# Altium project multi_power_amp.PrjPcb
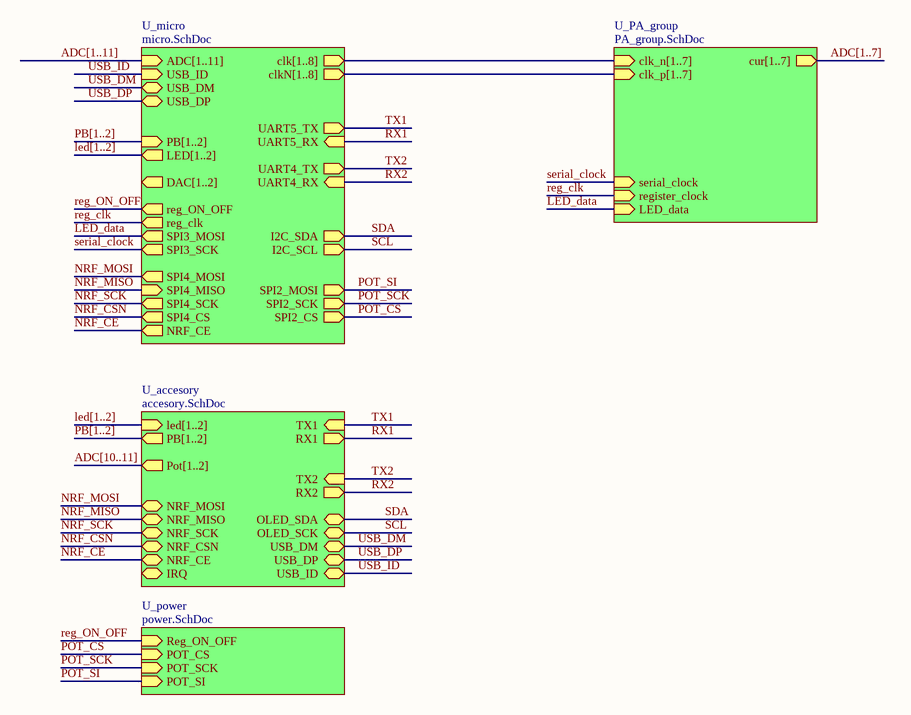
[diagram p0: top.SchDoc]
8 sheets, 274 parts. Net scope: hierarchical (ports join the sheet entries above them; power ports are global).
Board file: PowerAMP.PcbDoc
Sheets:
  top.SchDoc
    U_micro = micro.SchDoc
    U_accesory = accesory.SchDoc
    U_PA_group = PA_group.SchDoc
      PA1 = PA_classD.SchDoc
        L = led_PA.SchDoc
      PA2 = PA_classD.SchDoc
        L = led_PA.SchDoc
      PA3 = PA_classD.SchDoc
        L = led_PA.SchDoc
      PA4 = PA_classD.SchDoc
        L = led_PA.SchDoc
      PA5 = PA_classD.SchDoc
        L = led_PA.SchDoc
      PA6 = PA_classD.SchDoc
        L = led_PA.SchDoc
      PA7 = PA_classD.SchDoc
        L = led_PA.SchDoc
      Rect = rectifiers.SchDoc
    U_power = power.SchDoc

## Sheet top.SchDoc
size A4

### Sub-sheets
U_accesory = accesory.SchDoc: led[1..2] (in), PB[1..2] (out), Pot[1..2] (out), OLED_SCK (bidir), OLED_SDA (bidir), NRF_MISO (bidir), NRF_MOSI (bidir), NRF_SCK (bidir), NRF_CSN (bidir), NRF_CE (bidir), IRQ (bidir), RX1 (out), RX2 (out), TX1 (in), TX2 (in), USB_DM (bidir), USB_DP (bidir), USB_ID (bidir)
U_micro = micro.SchDoc: ADC[1..11] (in), DAC[1..2] (out), USB_ID (in), USB_DM (bidir), USB_DP (bidir), clk[1..8] (out), clkN[1..8] (out), SPI2_MOSI (out), SPI3_SCK (out), UART5_TX (out), SPI4_SCK (out), SPI4_CS (out), SPI4_MISO (in), SPI4_MOSI (out), SPI3_MOSI (out), UART5_RX (in), SPI2_SCK (out), SPI2_CS (out), I2C_SDA (out), I2C_SCL (out), LED[1..2] (out), PB[1..2] (in), reg_clk (out), reg_ON_OFF (out), NRF_CE (out), UART4_RX (in), UART4_TX (out)
U_PA_group = PA_group.SchDoc: serial_clock (in), register_clock (in), LED_data (in), clk_n[1..7] (in), clk_p[1..7] (in), cur[1..7] (out)
U_power = power.SchDoc: Reg_ON_OFF (in), POT_CS (in), POT_SCK (in), POT_SI (in)

### Nets
LED_data: sheet U_micro/SPI3_MOSI, sheet U_PA_group/LED_data
NRF_CE: sheet U_micro/NRF_CE, sheet U_accesory/NRF_CE
NRF_CSN: sheet U_micro/SPI4_CS, sheet U_accesory/NRF_CSN
NRF_MISO: sheet U_micro/SPI4_MISO, sheet U_accesory/NRF_MISO
NRF_MOSI: sheet U_micro/SPI4_MOSI, sheet U_accesory/NRF_MOSI
NRF_SCK: sheet U_micro/SPI4_SCK, sheet U_accesory/NRF_SCK
POT_CS: sheet U_micro/SPI2_CS, sheet U_power/POT_CS
POT_SCK: sheet U_micro/SPI2_SCK, sheet U_power/POT_SCK
POT_SI: sheet U_micro/SPI2_MOSI, sheet U_power/POT_SI
reg_clk: sheet U_micro/reg_clk, sheet U_PA_group/register_clock
reg_ON_OFF: sheet U_micro/reg_ON_OFF, sheet U_power/Reg_ON_OFF
RX1: sheet U_micro/UART5_RX, sheet U_accesory/RX1
RX2: sheet U_micro/UART4_RX, sheet U_accesory/RX2
SCL: sheet U_micro/I2C_SCL, sheet U_accesory/OLED_SCK  [project net I2C_SCL]
SDA: sheet U_micro/I2C_SDA, sheet U_accesory/OLED_SDA  [project net I2C_SDA]
serial_clock: sheet U_micro/SPI3_SCK, sheet U_PA_group/serial_clock
TX1: sheet U_micro/UART5_TX, sheet U_accesory/TX1
TX2: sheet U_micro/UART4_TX, sheet U_accesory/TX2
USB_DM: sheet U_micro/USB_DM, sheet U_accesory/USB_DM
USB_DP: sheet U_micro/USB_DP, sheet U_accesory/USB_DP
USB_ID: sheet U_micro/USB_ID, sheet U_accesory/USB_ID

### Buses and harness runs
bus ADC[1..7] = sheet U_PA_group/cur[1..7]
bus ADC[1..11] = sheet U_micro/ADC[1..11]
bus ADC[10..11] = sheet U_accesory/Pot[1..2]
bus led[1..2] = sheet U_accesory/led[1..2]
bus led[1..2] = sheet U_micro/LED[1..2]
bus PB[1..2] = sheet U_accesory/PB[1..2]
bus PB[1..2] = sheet U_micro/PB[1..2]
bus sheet U_micro/clk[1..8] = sheet U_PA_group/clk_n[1..7]
bus sheet U_micro/clkN[1..8] = sheet U_PA_group/clk_p[1..7]

## Sheet micro.SchDoc
size A4
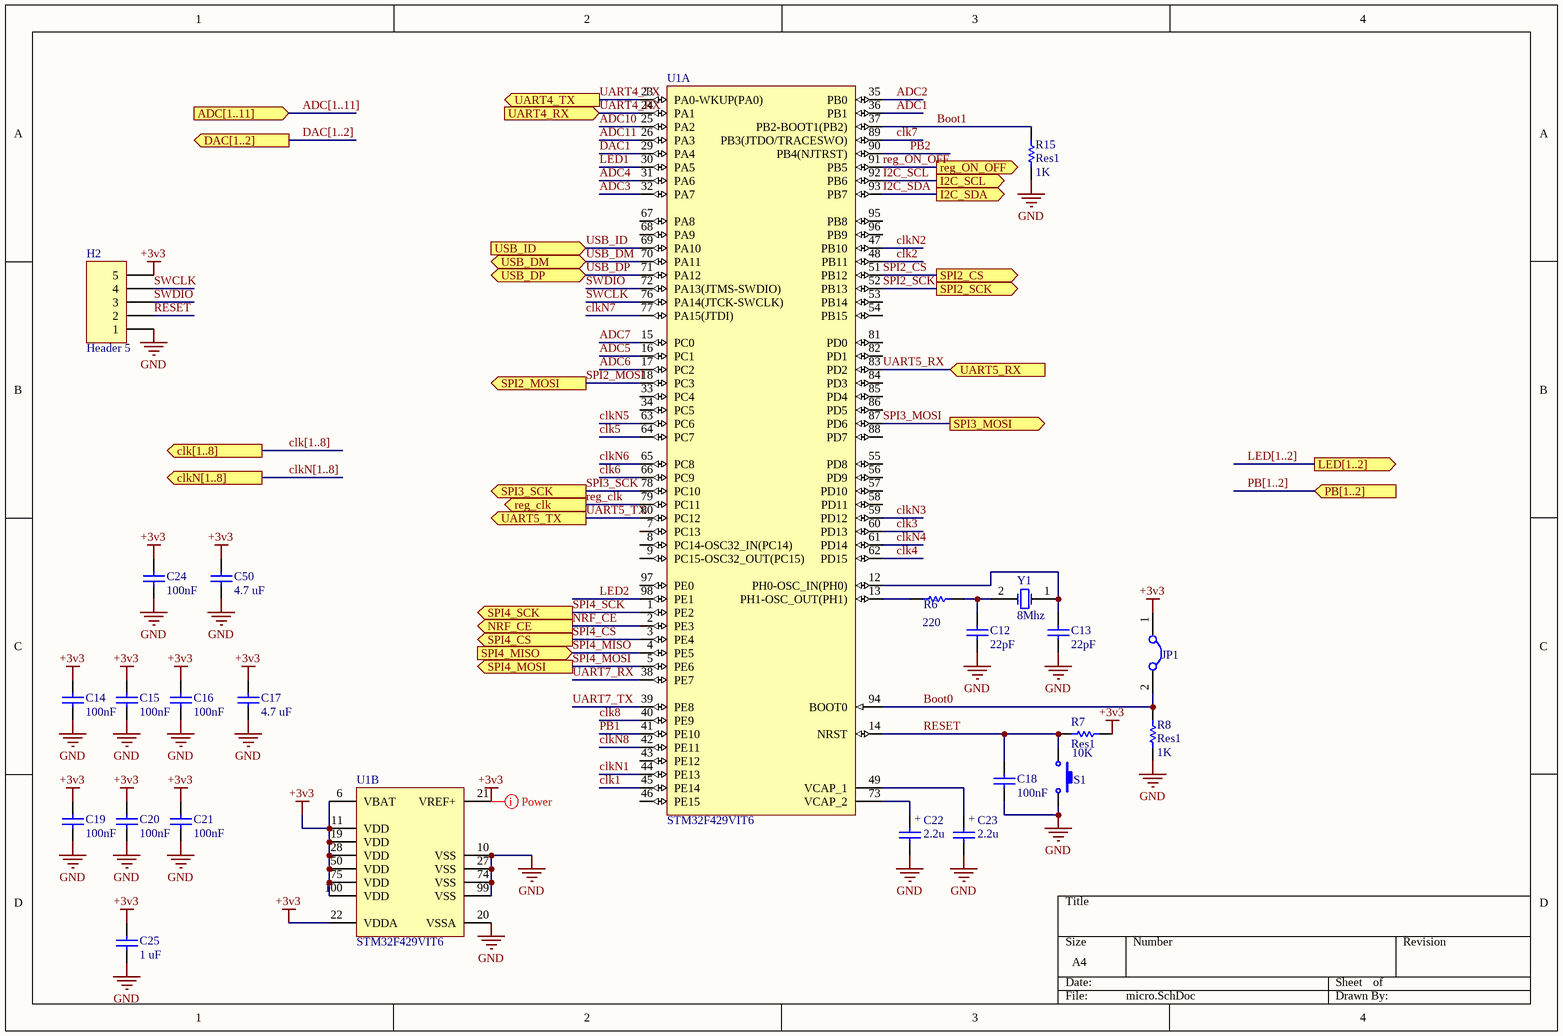
[diagram p1: micro.SchDoc]

### Parts
C12  value 22pF  [SMD_CAP_0805]  (hidden comment: Cap)
C13  value 22pF  [SMD_CAP_0805]  (hidden comment: Cap)
C14  100nF  [SMD_CAP_0805]
C15  100nF  [SMD_CAP_0805]
C16  100nF  [SMD_CAP_0805]
C17  value 4.7 uF  [SMD_CAP_0805]  (hidden comment: Cap)
C18  value 100nF  [SMD_CAP_0805]  (hidden comment: Cap)
C19  100nF  [SMD_CAP_0805]
C20  100nF  [SMD_CAP_0805]
C21  100nF  [SMD_CAP_0805]
C22  value 2.2u  [CAPP 1206 (3216X18L) Size A]  (hidden comment: tantal size a)
C23  value 2.2u  [CAPP 1206 (3216X18L) Size A]  (hidden comment: tantal size a)
C24  100nF  [SMD_CAP_0805]
C25  value 1 uF  [CAPP 1206 (3216X18L) Size A]  (hidden comment: Cap)
C50  value 4.7 uF  [SMD_CAP_0805]  (hidden comment: Cap)
H2  Header 5  [HDR1X5]
JP1  Jumper  [Jumper Small - 2.54 - GRAY]  (value not drawn)
R6  value 220  [RES 0805 (2012X06L)]  (hidden comment: Res1)
R7  Res1  value 10K  [RES 0805 (2012X06L)]
R8  Res1  value 1K  [RES 0805 (2012X06L)]
R15  Res1  value 1K  [RES 0805 (2012X06L)]
S1  Switch PB  [Switch - Push to On]  (value not drawn)
U1  STM32F429VIT6  [STM-LQFP100_M]  (parts A,B of 2)
Y1  8Mhz  [CRYSTAL Small]

### Ports
ADC[1..11] (in), clk[1..8] (out), clkN[1..8] (out), DAC[1..2] (out), I2C_SCL (out), I2C_SDA (out), LED[1..2] (out), NRF_CE (out), PB[1..2] (in), reg_clk (out), reg_ON_OFF (out), SPI2_CS (out), SPI2_MOSI (out), SPI2_SCK (out), SPI3_MOSI (out), SPI3_SCK (out), SPI4_CS (out), SPI4_MISO (in), SPI4_MOSI (out), SPI4_SCK (out), UART4_RX (in), UART4_TX (out), UART5_RX (in), UART5_TX (out), USB_DM (bidir), USB_DP (bidir), USB_ID (in)

### Nets
+3v3: C14.2 C15.2 C16.2 C17.1 C19.2 C20.2 C21.2 C24.2 C25.1 C50.1 H2.5 JP1.1 R7.1 U1.6(VBAT) U1.11(VDD) U1.19(VDD) U1.21(VREF+) U1.22(VDDA) U1.28(VDD) U1.50(VDD) U1.75(VDD) U1.100(VDD)
GND: C12.1 C13.1 C14.1 C15.1 C16.1 C17.2 C18.1 C19.1 C20.1 C21.1 C22.- C23.- C24.1 C25.2 C50.2 H2.1 R8.1 R15.1 S1.2 U1.10(VSS) U1.20(VSSA) U1.27(VSS) U1.74(VSS) U1.99(VSS)
ADC1: U1.36(PB1)
ADC2: U1.35(PB0)
ADC3: U1.32(PA7)
ADC4: U1.31(PA6)
ADC5: U1.16(PC1)
ADC6: U1.17(PC2)
ADC7: U1.15(PC0)
ADC10: U1.25(PA2)
ADC11: U1.26(PA3)
Boot0: JP1.2 R8.2 U1.94(BOOT0)
Boot1: R15.2 U1.37(PB2-BOOT1(PB2))
clk1: U1.45(PE14)
clk2: U1.48(PB11)
clk3: U1.60(PD13)
clk4: U1.62(PD15)
clk5: U1.64(PC7)
clk6: U1.66(PC9)
clk7: U1.89(PB3(JTDO/TRACESWO))
clk8: U1.40(PE9)
clkN1: U1.44(PE13)  [project net clk_p1]
clkN2: U1.47(PB10)  [project net clk_p2]
clkN3: U1.59(PD12)  [project net clk_p3]
clkN4: U1.61(PD14)  [project net clk_p4]
clkN5: U1.63(PC6)  [project net clk_p5]
clkN6: U1.65(PC8)  [project net clk_p6]
clkN7: U1.77(PA15(JTDI))  [project net clk_p7]
clkN8: U1.42(PE11)
DAC1: U1.29(PA4)
I2C_SCL: U1.92(PB6) ; port I2C_SCL
I2C_SDA: U1.93(PB7) ; port I2C_SDA
LED1: U1.30(PA5)
LED2: U1.98(PE1)
NRF_CE: U1.2(PE3) ; port NRF_CE
PB1: U1.41(PE10)
PB2: U1.90(PB4(NJTRST))
reg_clk: U1.79(PC11) ; port reg_clk
reg_ON_OFF: U1.91(PB5) ; port reg_ON_OFF
RESET: C18.2 H2.2 R7.2 S1.1 U1.14(NRST)
SPI2_CS: U1.51(PB12) ; port SPI2_CS  [project net POT_CS]
SPI2_MOSI: U1.18(PC3) ; port SPI2_MOSI  [project net POT_SI]
SPI2_SCK: U1.52(PB13) ; port SPI2_SCK  [project net POT_SCK]
SPI3_MOSI: U1.87(PD6) ; port SPI3_MOSI  [project net LED_data]
SPI3_SCK: U1.78(PC10) ; port SPI3_SCK  [project net serial_clock]
SPI4_CS: U1.3(PE4) ; port SPI4_CS  [project net NRF_CSN]
SPI4_MISO: U1.4(PE5) ; port SPI4_MISO  [project net NRF_MISO]
SPI4_MOSI: U1.5(PE6) ; port SPI4_MOSI  [project net NRF_MOSI]
SPI4_SCK: U1.1(PE2) ; port SPI4_SCK  [project net NRF_SCK]
SWCLK: H2.4 U1.76(PA14(JTCK-SWCLK))
SWDIO: H2.3 U1.72(PA13(JTMS-SWDIO))
UART4_RX: U1.24(PA1) ; port UART4_RX  [project net RX2]
UART4_TX: U1.23(PA0-WKUP(PA0)) ; port UART4_TX  [project net TX2]
UART5_RX: U1.83(PD2) ; port UART5_RX  [project net RX1]
UART5_TX: U1.80(PC12) ; port UART5_TX  [project net TX1]
UART7_RX: U1.38(PE7)
UART7_TX: U1.39(PE8)
USB_DM: U1.70(PA11) ; port USB_DM
USB_DP: U1.71(PA12) ; port USB_DP
USB_ID: U1.69(PA10) ; port USB_ID
NetC12_2: C12.2 R6.2 Y1.2(OSC2)
NetC13_2: C13.2 U1.12(PH0-OSC_IN(PH0)) Y1.1(OSC1)
NetC22_+: C22.+ U1.73(VCAP_2)
NetC23_+: C23.+ U1.49(VCAP_1)
NetR6_1: R6.1 U1.13(PH1-OSC_OUT(PH1))

Not connected (* = marked no-connect by the designer): U1 7(PC13) 8(PC14-OSC32_IN(PC14)) 9(PC15-OSC32_OUT(PC15)) 33(PC4) 34(PC5) 43(PE12) 46(PE15) 53(PB14) 54(PB15) 55(PD8) 56(PD9) 57(PD10) 58(PD11) 67(PA8) 68(PA9) 81(PD0) 82(PD1) 84(PD3) 85(PD4) 86(PD5) 88(PD7) 95(PB8) 96(PB9) 97(PE0)

### Buses and harness runs
bus ADC[1..11] = port ADC[1..11]
bus clk[1..8] = port clk[1..8]
bus clkN[1..8] = port clkN[1..8]
bus DAC[1..2] = port DAC[1..2]
bus LED[1..2] = port LED[1..2]
bus PB[1..2] = port PB[1..2]

### Layout directives
net class Power: +3v3

### Library data of the parts
C12-C16 C18-C21 C24 = Cap: Capacitor; Published: 8-Jun-2000; LatestRevisionDate: 17-Jul-2002; LatestRevisionNote: Re-released for DXP Platform.; PackageReference: RAD-0.3; Publisher: Altium Limited; PackageDescription: Radial Cap, Thru-Hole; 2 Leads; 0.3 in Pin Spacing
  C14-C16 C19-C21 C24: Value: 100nF
C22 C23 = Cap Pol: pin to pad: +>1 ->2
H2 = Header 5: Header, 5-Pin; LatestRevisionDate: 17-Jul-2002; LatestRevisionNote: Re-released for DXP Platform.; Publisher: Altium Limited
JP1 = Jumper: Company: E.P.I.L; Defualt State: Close; Design Date: 2011/11/02
R6-R8 R15 = Res1: Resistor; Published: 8-Jun-2000; LatestRevisionDate: 17-Jul-2002; LatestRevisionNote: Re-released for DXP Platform.; PackageReference: AXIAL-0.3; Publisher: Altium Limited; PackageDescription: Axial Device, Thru-Hole; 2 Leads; 0.3 in Pin Spacing
S1 = Switch PB: Push Button Switch
U1 = STM32F429VIT6: ARM Cortex-M4 32-bit MCU+FPU, 225 DMIPS, 2048 kB Flash, 256 kB Internal RAM, 82 I/Os, 100-pin LQFP, -40 to 85 degC, Tray; Manufacturer: STMicroelectronics; D/A Converter: 2x12-bit; FLASH Size (Prog) (kB): 2048; I/Os (High Current): 82; Internal RAM Size (kB): 256; Operating Frequency(F) (Processor speed) (MHz): 180; Supply Voltage(Vcc) max (V): 3.6; Supply Voltage(Vcc) min (V): 1.8; DatasheetVersion: Rev. 2; PackageVersion: Rev. 1, 06/2013; PackageReference: LQFP100; PackageDescription: 100-Pin Low Profile Quad Flat Package, 14 x 14 mm Body, 0.5 mm Pitch; Supplier 1: Digi-Key; Supplier Part Number 1: 497-14052-ND; Supplier 2: Newark; Supplier Part Number 2: 06X3674; Supplier 3: Mouser; Supplier Part Number 3: 511-STM32F429VIT6; Core: ARM Cortex-M4; Packing: Tray; Mounting Technology: Surface Mount; PartNumber: STM32F429VIT6; ComponentLink1Description: Manufacturer URL; ComponentLink1URL: http://www.st.com/web/en/home.html; ComponentLink2Description: Datasheet; ComponentLink2URL: http://www.st.com/st-web-ui/static/active/en/resource/technical/document/data_brief/DM00053488.pdf; ComponentLink3Description: Package Specification; ComponentLink3URL: http://www.st.com/st-web-ui/static/active/en/resource/technical/document/data_brief/DM00071938.pdf
Y1 = XTAL: Crystal Oscillator; Published: 8-Jun-2000; LatestRevisionDate: 17-Jul-2002; LatestRevisionNote: Re-released for DXP Platform.; PackageReference: R38; Publisher: Altium Limited; PackageDescription: Crystal, Thru-Hole; 2 Leads; Body 3.1 x 8.2 mm (Dia.xH)

## Sheet accesory.SchDoc
size A4
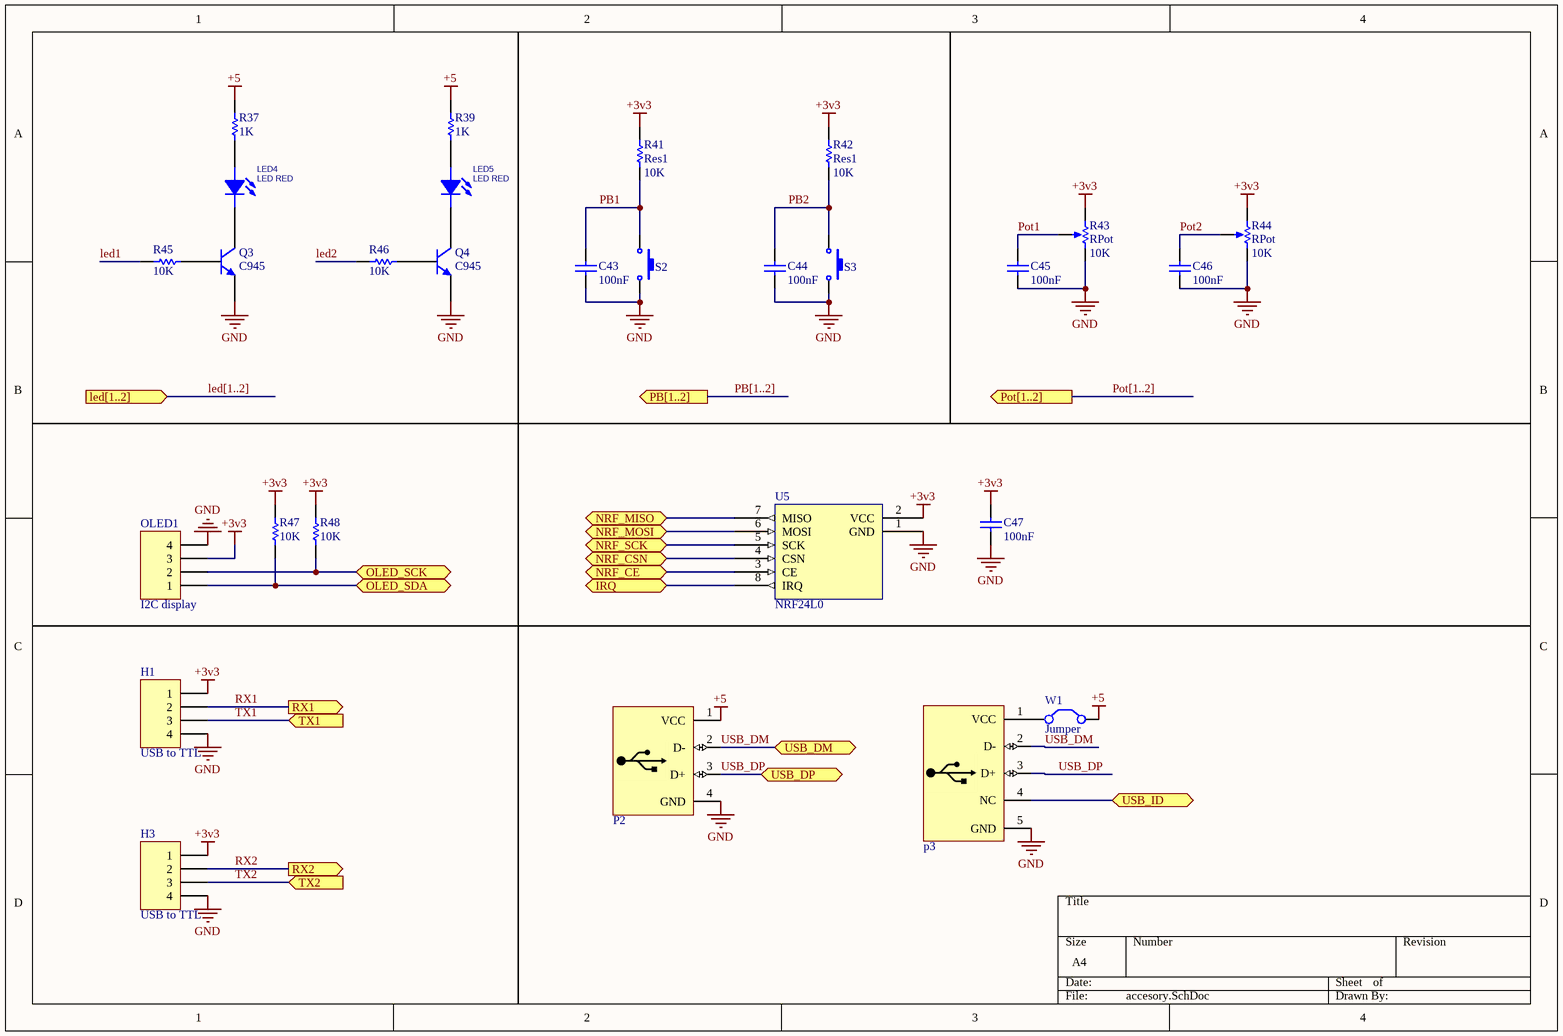
[diagram p2: accesory.SchDoc]

### Parts
C43  value 100nF  [SMD_CAP_0805]  (hidden comment: Cap)
C44  value 100nF  [SMD_CAP_0805]  (hidden comment: Cap)
C45  value 100nF  [SMD_CAP_0805]  (hidden comment: Cap)
C46  value 100nF  [SMD_CAP_0805]  (hidden comment: Cap)
C47  value 100nF  [SMD_CAP_0805]  (hidden comment: Cap)
H1  USB to TTL  [HDR1X4]
H3  USB to TTL  [HDR1X4]
LED4  LED RED  [led_0805]
LED5  LED RED  [led_0805]
OLED1  I2C display  [HDR1X4]
P2  USB Connector  [USB2.5-2H4C]  (value not drawn)
p3  USB Connector  [USB_AB_BM_SHS]  (value not drawn)
Q3  C945  [SOT23_N]
Q4  C945  [SOT23_N]
R37  1K  [RES 0805 (2012X06L)]
R39  1K  [RES 0805 (2012X06L)]
R41  Res1  value 10K  [RES 0805 (2012X06L)]
R42  Res1  value 10K  [RES 0805 (2012X06L)]
R43  RPot  value 10K  [Multi Turn 02]
R44  RPot  value 10K  [Multi Turn 02]
R45  value 10K  [RES 0805 (2012X06L)]  (hidden comment: Res1)
R46  value 10K  [RES 0805 (2012X06L)]  (hidden comment: Res1)
R47  value 10K  [RES 0805 (2012X06L)]  (hidden comment: Res1)
R48  value 10K  [RES 0805 (2012X06L)]  (hidden comment: Res1)
S2  Switch PB  [Switch - Push to On]  (value not drawn)
S3  Switch PB  [Switch - Push to On]  (value not drawn)
U5  NRF24L0  [RF24-MICRO STRIP]
W1  Jumper  [Jumper SMD]

### Ports
IRQ (bidir), led[1..2] (in), NRF_CE (bidir), NRF_CSN (bidir), NRF_MISO (bidir), NRF_MOSI (bidir), NRF_SCK (bidir), OLED_SCK (bidir), OLED_SDA (bidir), PB[1..2] (out), Pot[1..2] (out), RX1 (out), RX2 (out), TX1 (in), TX2 (in), USB_DM (bidir), USB_DP (bidir), USB_ID (bidir)

### Nets
+3v3: C47.2 H1.1 H3.1 OLED1.3 R41.1 R42.1 R43.1(TOP) R44.1(TOP) R47.2 R48.2 U5.2(VCC)
+5: P2.1(VCC) R37.2 R39.2 W1.2(C2)
GND: C43.1 C44.1 C45.1 C46.1 C47.1 H1.4 H3.4 OLED1.4 P2.4(GND) p3.5(GND) Q3.2(E) Q4.2(E) R43.2(BOT) R44.2(BOT) S2.2 S3.2 U5.1(GND)
I2C_SCL: OLED1.2 R48.1 ; port OLED_SCK
I2C_SDA: OLED1.1 R47.1 ; port OLED_SDA
LED1: R45.1
LED2: R46.1
NRF_CE: U5.3(CE) ; port NRF_CE
NRF_CSN: U5.4(CSN) ; port NRF_CSN
NRF_MISO: U5.7(MISO) ; port NRF_MISO
NRF_MOSI: U5.6(MOSI) ; port NRF_MOSI
NRF_SCK: U5.5(SCK) ; port NRF_SCK
PB1: C43.2 R41.2 S2.1
PB2: C44.2 R42.2 S3.1
Pot1: C45.2 R43.3(TAP)  [project net ADC10]
Pot2: C46.2 R44.3(TAP)  [project net ADC11]
RX1: H1.2 ; port RX1
RX2: H3.2 ; port RX2
TX1: H1.3 ; port TX1
TX2: H3.3 ; port TX2
USB_DM: P2.2(D-) p3.2(D-) ; port USB_DM
USB_DP: P2.3(D+) p3.3(D+) ; port USB_DP
USB_ID: p3.4(NC) ; port USB_ID
NetLED4_1: LED4.1(ANODE) R37.1
NetLED4_2: LED4.2(CATHODE) Q3.3(C)
NetLED5_1: LED5.1(ANODE) R39.1
NetLED5_2: LED5.2(CATHODE) Q4.3(C)
Netp3_1: p3.1(VCC) W1.1(C1)
NetQ3_1: Q3.1(B) R45.2
NetQ4_1: Q4.1(B) R46.2
NetU5_8: U5.8(IRQ) ; port IRQ

### Buses and harness runs
bus led[1..2] = port led[1..2]
bus PB[1..2] = port PB[1..2]
bus Pot[1..2] = port Pot[1..2]

### Library data of the parts
C43-C47 = Cap: Capacitor; Published: 8-Jun-2000; LatestRevisionDate: 17-Jul-2002; LatestRevisionNote: Re-released for DXP Platform.; PackageReference: RAD-0.3; Publisher: Altium Limited; PackageDescription: Radial Cap, Thru-Hole; 2 Leads; 0.3 in Pin Spacing
H1 H3 = H-1x4
LED4 LED5 = LED 5MM: Light Emitting Diode; Designer: Abbas Basereh; Data: 16-12-2016; Link: *; Part.No: *
OLED1 = Header 4: Header, 4-Pin; LatestRevisionDate: 17-Jul-2002; LatestRevisionNote: Re-released for DXP Platform.; Publisher: Altium Limited
P2 = USB A-Type: USB Connector-A Type
p3 = USB MICRO: USB Connector MICRO-B Type; Designer: ABBAS BASEREH; Max Current: 1600mA; Mounting Technology: Surface Mount\Through-Hole; Category: Connector; Pin Count: 5-7; Publisher: ABBAS BASEREH; Status: Unreleased; ComponentLink1Description: Datasheet; ComponentLink2Description: Reference; Update: 1395-11-17
Q3 Q4 = C945: NPN Silicon Epitaxial Planar Transistor; Published: 2017-2-8; LatestRevisionDate: 2017; LatestRevisionNote: IPC-7351 Footprint Added.; DatasheetVersion: 2017; PackageVersion: 2017-2-8; PackageReference: SOT23; Publisher: Abbas Basereh; PackageDescription: 3-Pin SOT-23 Package 0.95 mm Pitch, 2.3 mm Lead Span; ComponentLink1Description: Manufacturer Link; ComponentLink1URL: http://www.taitroncomponents.com/; ComponentLink2Description: Datasheet; ComponentLink2URL: http://www.taitroncomponents.com/
R37 R39 = RES Axial 0.25W: Designer: Abbas Basereh; Desc.: RES Axial 0.25W; Data: 4-1-2017
R41 R42 R45-R48 = Res1: Resistor; Published: 8-Jun-2000; LatestRevisionDate: 17-Jul-2002; LatestRevisionNote: Re-released for DXP Platform.; PackageReference: AXIAL-0.3; Publisher: Altium Limited; PackageDescription: Axial Device, Thru-Hole; 2 Leads; 0.3 in Pin Spacing
R43 R44 = RPot: Potentiometer; Sim Note: Enter the Resistance value and the set point into parameter fields.; Set Position: 0.5; Published: 8-Jun-2000; LatestRevisionDate: 17-Jul-2002; LatestRevisionNote: Re-released for DXP Platform.; PackageReference: VR5; Publisher: Altium Limited; PackageDescription: Variable Resistor, Thru-Hole; 3 Leads
S2 S3 = Switch PB: Push Button Switch
U5 = NRF24
W1 = Jumper: Jumper Wire; Published: 24-Mar-1999; LatestRevisionDate: 17-Jul-2002; LatestRevisionNote: Re-released for DXP Platform.; PackageReference: RAD-0.2; Publisher: Altium Limited; PackageDescription: Radial Cap, Thru-Hole; 2 Leads; 0.2 in Pin Spacing

## Sheet PA_group.SchDoc
size A4
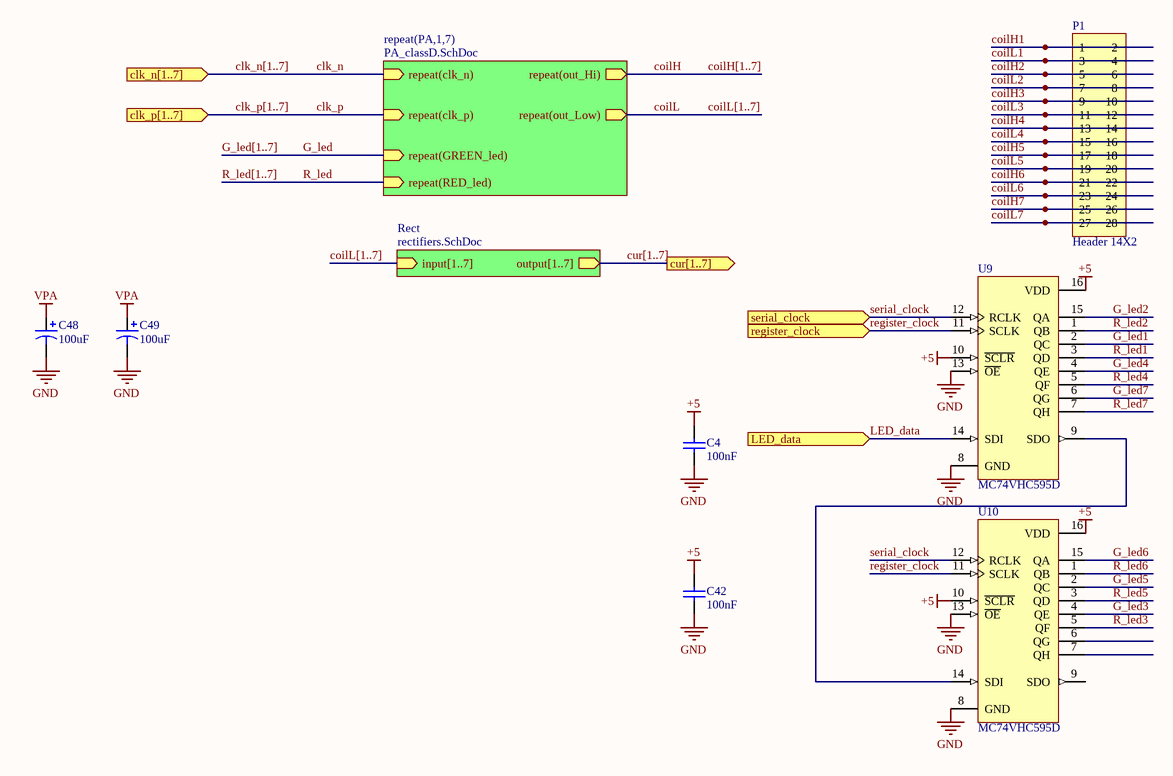
[diagram p3: PA_group.SchDoc]

### Parts
C4  value 100nF  [SMD_CAP_0805]  (hidden comment: Cap)
C42  value 100nF  [SMD_CAP_0805]  (hidden comment: Cap)
C48  value 100uF  [Cap SMD electrolite-6.3mm]
C49  value 100uF  [Cap SMD electrolite-6.3mm]
P1  Header 14X2  [HDR2X14]
U9  MC74VHC595D  [751B-05_N]
U10  MC74VHC595D  [751B-05_N]

### Sub-sheets
Rect = rectifiers.SchDoc: input[1..7] (in), output[1..7] (out)
repeat(PA,1,7) = PA_classD.SchDoc: repeat(clk_n) (in), repeat(clk_p) (in), repeat(out_Hi) (out), repeat(out_Low) (out), repeat(GREEN_led) (in), repeat(RED_led) (in)

### Ports
clk_n[1..7] (in), clk_p[1..7] (in), cur[1..7] (out), LED_data (in), register_clock (in), serial_clock (in)

### Nets
+5: C4.1 C42.1 U9.10(~{SCLR}) U9.16(VDD) U10.10(~{SCLR}) U10.16(VDD)
GND: C4.2 C42.2 C48.2 C49.2 U9.8(GND) U9.13(~{OE}) U10.8(GND) U10.13(~{OE})
VPA: C48.1 C49.1
clk_n: sheet repeat(PA,1,7)/repeat(clk_n)
clk_p: sheet repeat(PA,1,7)/repeat(clk_p)
coilH: sheet repeat(PA,1,7)/repeat(out_Hi)
coilH1: P1.1 P1.2
coilH2: P1.5 P1.6
coilH3: P1.9 P1.10
coilH4: P1.13 P1.14
coilH5: P1.17 P1.18
coilH6: P1.21 P1.22
coilH7: P1.25 P1.26
coilL: sheet repeat(PA,1,7)/repeat(out_Low)
coilL1: P1.3 P1.4
coilL2: P1.7 P1.8
coilL3: P1.11 P1.12
coilL4: P1.15 P1.16
coilL5: P1.19 P1.20
coilL6: P1.23 P1.24
coilL7: P1.27 P1.28
G_led: sheet repeat(PA,1,7)/repeat(GREEN_led)
G_led1: U9.2(QC)
G_led2: U9.15(QA)
G_led3: U10.4(QE)
G_led4: U9.4(QE)
G_led5: U10.2(QC)
G_led6: U10.15(QA)
G_led7: U9.6(QG)
LED_data: U9.14(SDI) ; port LED_data
R_led: sheet repeat(PA,1,7)/repeat(RED_led)
R_led1: U9.3(QD)
R_led2: U9.1(QB)
R_led3: U10.5(QF)
R_led4: U9.5(QF)
R_led5: U10.3(QD)
R_led6: U10.1(QB)
R_led7: U9.7(QH)
register_clock: U9.11(SCLK) U10.11(SCLK) ; port register_clock  [project net reg_clk]
serial_clock: U9.12(RCLK) U10.12(RCLK) ; port serial_clock
NetU9_9: U9.9(SDO) U10.14(SDI)

Not connected (* = marked no-connect by the designer): U10 6(QG) 7(QH) 9(SDO)

### Buses and harness runs
bus clk_n[1..7] = port clk_n[1..7]
bus clk_p[1..7] = port clk_p[1..7]
bus coilH[1..7]
bus coilL[1..7]
bus coilL[1..7] = sheet Rect/input[1..7]
bus cur[1..7] = port cur[1..7] = sheet Rect/output[1..7]
bus G_led[1..7]
bus R_led[1..7]

### Library data of the parts
C4 C42 = Cap ceramic: CAP-100Nf
C48 C49 = Cap Pol1: Polarized Capacitor (Radial); Published: 8-Jun-2000; LatestRevisionDate: 17-Jul-2002; LatestRevisionNote: Re-released for DXP Platform.; PackageReference: RB7.6-15; Publisher: Altium Limited; PackageDescription: Polarized Capacitor (Radial); 2 Leads
P1 = Header 14X2: Header, 14-Pin, Dual row; LatestRevisionDate: 17-Jul-2002; LatestRevisionNote: Re-released for DXP Platform.; Publisher: Altium Limited
U9 U10 = MC74VHC595D: 8-Bit 3-State Shift Register with Output Storage Register; ComponentAvailability: Not for New Design; Published: 15-Apr-2002; LatestRevisionDate: 13-Apr-2006; LatestRevisionNote: IPC-7351 Footprint Added.; DatasheetVersion: 1997; PackageVersion: Oct-1999; PackageReference: 751B-05; Publisher: Altium Limited; PackageDescription: 16-Pin Small Outline Integrated Circuit 1.27 mm Pitch; Code_JEDEC: MS-012-AC; Code_IPC: SOIC127P600-16; ComponentLink1Description: Manufacturer Link; ComponentLink1URL: http://www.onsemi.com/; ComponentLink2Description: Datasheet; ComponentLink2URL: http://www.onsemi.com/pub/Collateral/MC74VHC595-D.PDF

## Sheet PA_classD.SchDoc
size A4
Used 7 times, as channels U_PA_group/PA1, U_PA_group/PA2, U_PA_group/PA3, U_PA_group/PA4, U_PA_group/PA5, U_PA_group/PA6, U_PA_group/PA7. Parts and nets are listed once, with the designators drawn on the sheet.
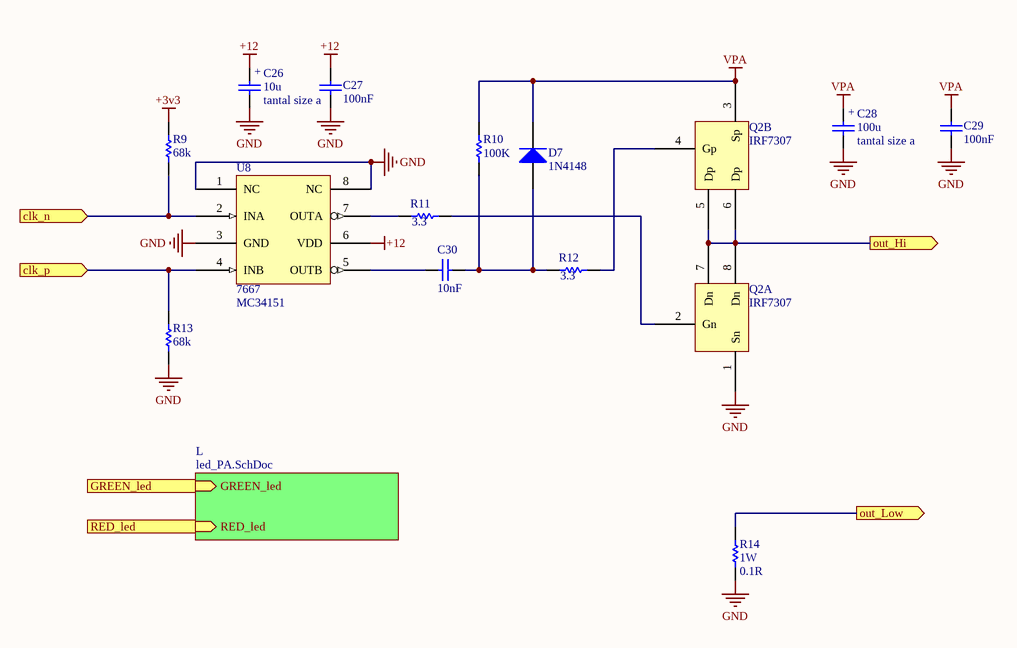
[diagram p4: PA_classD.SchDoc]

### Parts
C26  tantal size a  value 10u  [CAPP 1206 (3216X18L) Size A]
C27  value 100nF  [SMD_CAP_0805]  (hidden comment: Cap)
C28  tantal size a  value 100u  [CAPP 1206 (3216X18L) Size A]
C29  value 100nF  [SMD_CAP_0805]  (hidden comment: Cap)
C30  value 10nF  [SMD_CAP_0805]  (hidden comment: Cap)
D7  1N4148  [LL4148]
Q2  IRF7307  [SO8_M]  (parts A,B of 2)
R9  value 68k  [RES 0805 (2012X06L)]  (hidden comment: Res1)
R10  value 100K  [RES 0805 (2012X06L)]  (hidden comment: Res1)
R11  value 3.3  [RES 0805 (2012X06L)]  (hidden comment: Res1)
R12  value 3.3  [RES 0805 (2012X06L)]  (hidden comment: Res1)
R13  value 68k  [RES 0805 (2012X06L)]  (hidden comment: Res1)
R14  1W  value 0.1R  [Axial 1W  7_0mm]
U8  7667  [SO8_M]

### Sub-sheets
L = led_PA.SchDoc: GREEN_led (in), RED_led (in)

### Ports
clk_n (in), clk_p (in), GREEN_led (in), out_Hi (out), out_Low (out), RED_led (in)

### Nets
+3v3: R9.1
+12: C26.+ C27.1 U8.6(VDD)
GND: C26.- C27.2 C28.- C29.2 Q2.1(Sn) R13.2 R14.1 U8.1(NC) U8.3(GND) U8.8(NC)
VPA: C28.+ C29.1 D7.2(K) Q2.3(Sp) R10.1
clk_n: R9.2 U8.2(INA) ; port clk_n
clk_p: R13.1 U8.4(INB) ; port clk_p
GREEN_led: port GREEN_led, sheet L/GREEN_led
out_Hi: Q2.5(Dp) Q2.6(Dp) Q2.7(Dn) Q2.8(Dn) ; port out_Hi
out_Low: R14.2 ; port out_Low
RED_led: port RED_led, sheet L/RED_led
NetC30_1: C30.1 U8.5(OUTB)
NetC30_2: C30.2 D7.1(A) R10.2 R12.2
NetQ2_2: Q2.2(Gn) R11.1
NetQ2_4: Q2.4(Gp) R12.1
NetR11_2: R11.2 U8.7(OUTA)

### Channels
U_PA_group/PA1: designators end in _PA1; ports clk_n=clk1 clk_p=clk_p1 GREEN_led=G_led1 out_Hi=coilH1 out_Low=coilL1 RED_led=R_led1
U_PA_group/PA2: designators end in _PA2; ports clk_n=clk2 clk_p=clk_p2 GREEN_led=G_led2 out_Hi=coilH2 out_Low=coilL2 RED_led=R_led2
U_PA_group/PA3: designators end in _PA3; ports clk_n=clk3 clk_p=clk_p3 GREEN_led=G_led3 out_Hi=coilH3 out_Low=coilL3 RED_led=R_led3
U_PA_group/PA4: designators end in _PA4; ports clk_n=clk4 clk_p=clk_p4 GREEN_led=G_led4 out_Hi=coilH4 out_Low=coilL4 RED_led=R_led4
U_PA_group/PA5: designators end in _PA5; ports clk_n=clk5 clk_p=clk_p5 GREEN_led=G_led5 out_Hi=coilH5 out_Low=coilL5 RED_led=R_led5
U_PA_group/PA6: designators end in _PA6; ports clk_n=clk6 clk_p=clk_p6 GREEN_led=G_led6 out_Hi=coilH6 out_Low=coilL6 RED_led=R_led6
U_PA_group/PA7: designators end in _PA7; ports clk_n=clk7 clk_p=clk_p7 GREEN_led=G_led7 out_Hi=coilH7 out_Low=coilL7 RED_led=R_led7

### Notes on the sheet
- (near U8) MC34151

### Library data of the parts
C26 C28 = Cap Pol: pin to pad: +>1 ->2
C27 C29 C30 = Cap ceramic: CAP-100Nf
D7 = Diode 1N4148: High Conductance Fast Diode; Published: 8-Jun-2000; LatestRevisionDate: 17-Jul-2002; LatestRevisionNote: Re-released for DXP Platform.; DatasheetVersion: 1997; PackageReference: DO-35; Publisher: Altium Limited; PackageDescription: Diode, Axial; Body 3.8 x 1.9 mm (LxDia. max), Lead Dia. 0.53 mm (max); Code_JEDEC: DO-204-AH; ComponentLink1Description: Manufacturer Link; ComponentLink1URL: http://www.fairchildsemi.com/; ComponentLink2Description: Datasheet; ComponentLink2URL: http://www.fairchildsemi.com/ds/1N%2F1N4148.pdf
Q2 = IRF7106
R9-R14 = Res1: Resistor; Published: 8-Jun-2000; LatestRevisionDate: 17-Jul-2002; LatestRevisionNote: Re-released for DXP Platform.; PackageReference: AXIAL-0.3; Publisher: Altium Limited; PackageDescription: Axial Device, Thru-Hole; 2 Leads; 0.3 in Pin Spacing
U8 = ICL7667

## Sheet led_PA.SchDoc
size A4
Used 7 times, as channels U_PA_group/PA1/L, U_PA_group/PA2/L, U_PA_group/PA3/L, U_PA_group/PA4/L, U_PA_group/PA5/L, U_PA_group/PA6/L, U_PA_group/PA7/L. Parts and nets are listed once, with the designators drawn on the sheet.
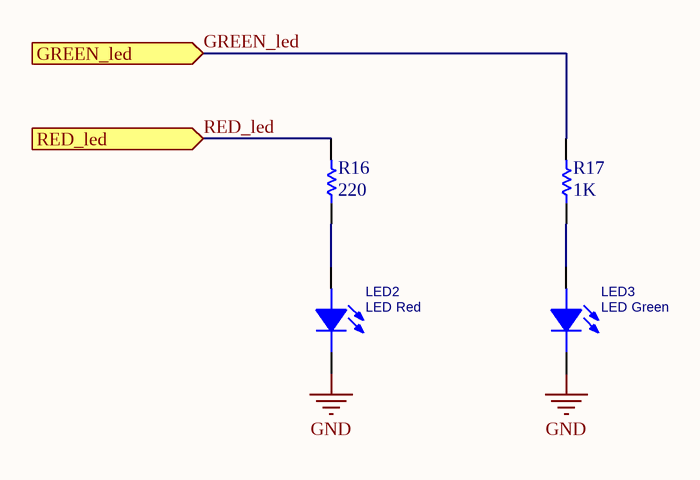
[diagram p5: led_PA.SchDoc]

### Parts
LED2  LED Red  [led_0805]
LED3  LED Green  [led_0805]
R16  220  [RES 0805 (2012X06L)]
R17  1K  [RES 0805 (2012X06L)]

### Ports
GREEN_led (in), RED_led (in)

### Nets
GND: LED2.2(CATHODE) LED3.2(CATHODE)
GREEN_led: R17.2 ; port GREEN_led
RED_led: R16.2 ; port RED_led
NetLED2_1: LED2.1(ANODE) R16.1
NetLED3_1: LED3.1(ANODE) R17.1

### Channels
U_PA_group/PA1/L: designators end in _U_PA_group_PA1_L; ports GREEN_led=G_led1 RED_led=R_led1
U_PA_group/PA2/L: designators end in _U_PA_group_PA2_L; ports GREEN_led=G_led2 RED_led=R_led2
U_PA_group/PA3/L: designators end in _U_PA_group_PA3_L; ports GREEN_led=G_led3 RED_led=R_led3
U_PA_group/PA4/L: designators end in _U_PA_group_PA4_L; ports GREEN_led=G_led4 RED_led=R_led4
U_PA_group/PA5/L: designators end in _U_PA_group_PA5_L; ports GREEN_led=G_led5 RED_led=R_led5
U_PA_group/PA6/L: designators end in _U_PA_group_PA6_L; ports GREEN_led=G_led6 RED_led=R_led6
U_PA_group/PA7/L: designators end in _U_PA_group_PA7_L; ports GREEN_led=G_led7 RED_led=R_led7

### Library data of the parts
LED2 LED3 = LED 5MM: as LED4 on sheet accesory; Data: 16-12-2016; Link: *; Part.No: *
R16 R17 = RES Axial 0.25W: Designer: Abbas Basereh; Desc.: RES Axial 0.25W; Data: 4-1-2017

## Sheet rectifiers.SchDoc
size A3
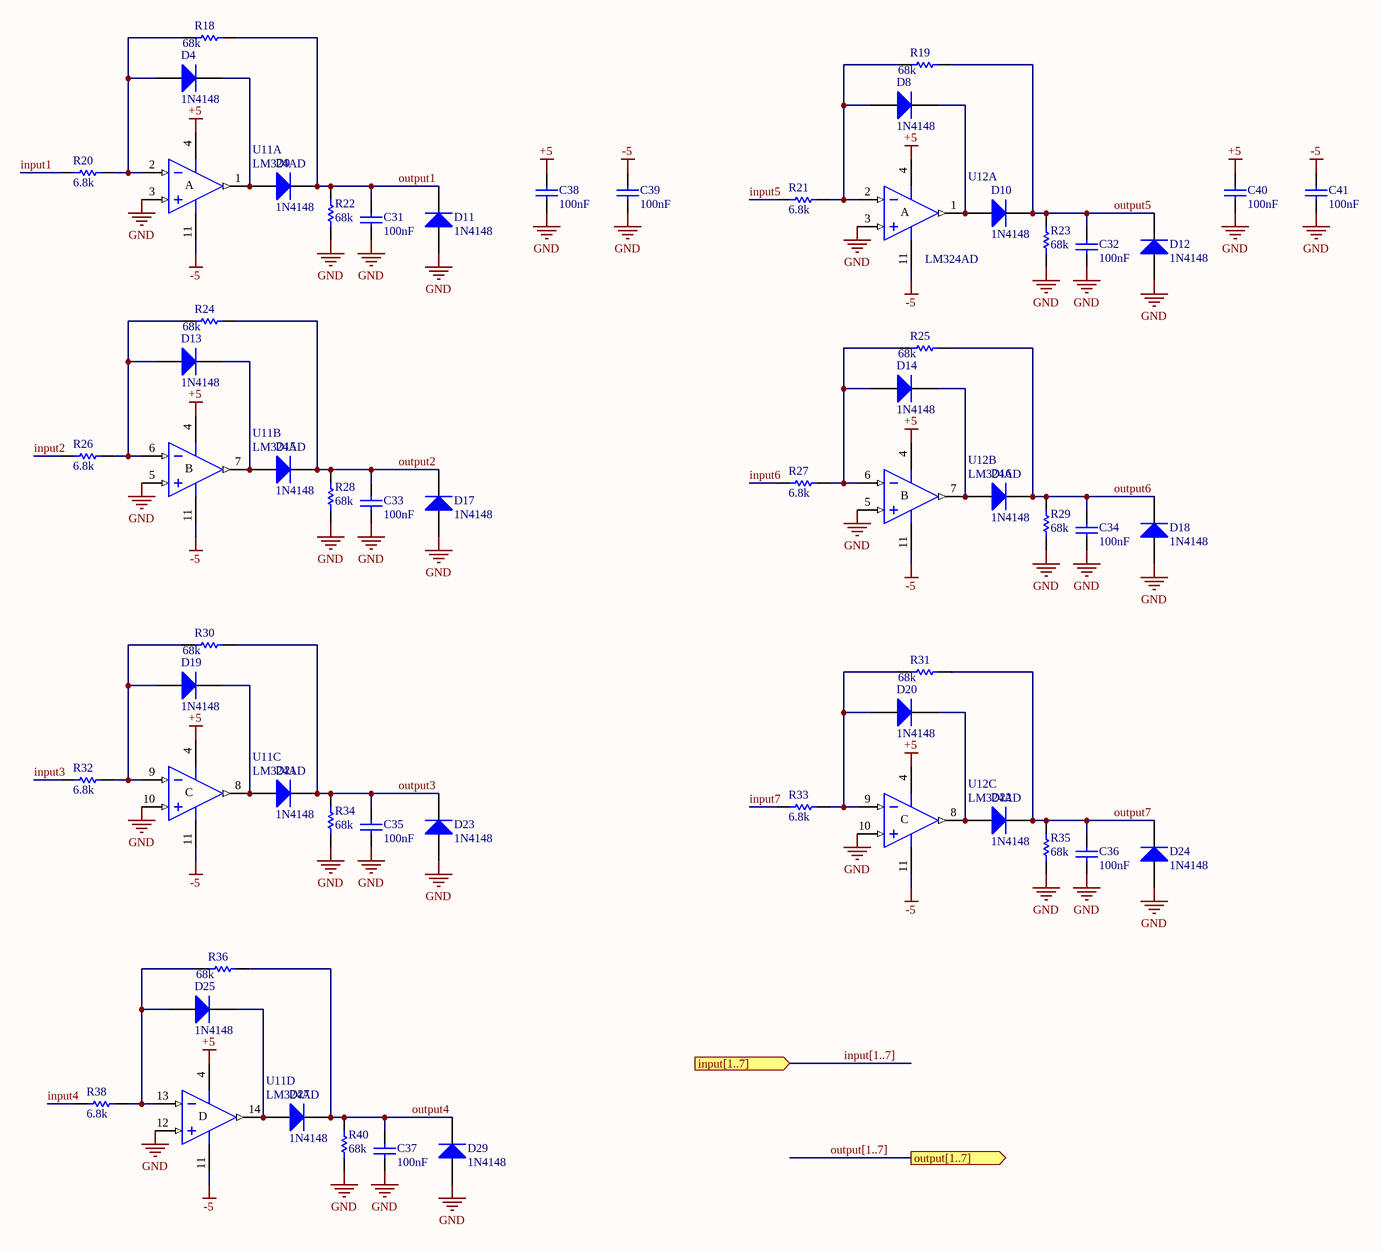
[diagram p6: rectifiers.SchDoc]

### Parts
C31  value 100nF  [SMD_CAP_0805]  (hidden comment: Cap)
C32  value 100nF  [SMD_CAP_0805]  (hidden comment: Cap)
C33  value 100nF  [SMD_CAP_0805]  (hidden comment: Cap)
C34  value 100nF  [SMD_CAP_0805]  (hidden comment: Cap)
C35  value 100nF  [SMD_CAP_0805]  (hidden comment: Cap)
C36  value 100nF  [SMD_CAP_0805]  (hidden comment: Cap)
C37  value 100nF  [SMD_CAP_0805]  (hidden comment: Cap)
C38  value 100nF  [SMD_CAP_0805]  (hidden comment: Cap)
C39  value 100nF  [SMD_CAP_0805]  (hidden comment: Cap)
C40  value 100nF  [SMD_CAP_0805]  (hidden comment: Cap)
C41  value 100nF  [SMD_CAP_0805]  (hidden comment: Cap)
D4  1N4148  [LL4148]
D8  1N4148  [LL4148]
D9  1N4148  [LL4148]
D10  1N4148  [LL4148]
D11  1N4148  [LL4148]
D12  1N4148  [LL4148]
D13  1N4148  [LL4148]
D14  1N4148  [LL4148]
D15  1N4148  [LL4148]
D16  1N4148  [LL4148]
D17  1N4148  [LL4148]
D18  1N4148  [LL4148]
D19  1N4148  [LL4148]
D20  1N4148  [LL4148]
D21  1N4148  [LL4148]
D22  1N4148  [LL4148]
D23  1N4148  [LL4148]
D24  1N4148  [LL4148]
D25  1N4148  [LL4148]
D27  1N4148  [LL4148]
D29  1N4148  [LL4148]
R18  value 68k  [RES 0805 (2012X06L)]  (hidden comment: Res1)
R19  value 68k  [RES 0805 (2012X06L)]  (hidden comment: Res1)
R20  value 6.8k  [RES 0805 (2012X06L)]  (hidden comment: Res1)
R21  value 6.8k  [RES 0805 (2012X06L)]  (hidden comment: Res1)
R22  value 68k  [RES 0805 (2012X06L)]  (hidden comment: Res1)
R23  value 68k  [RES 0805 (2012X06L)]  (hidden comment: Res1)
R24  value 68k  [RES 0805 (2012X06L)]  (hidden comment: Res1)
R25  value 68k  [RES 0805 (2012X06L)]  (hidden comment: Res1)
R26  value 6.8k  [RES 0805 (2012X06L)]  (hidden comment: Res1)
R27  value 6.8k  [RES 0805 (2012X06L)]  (hidden comment: Res1)
R28  value 68k  [RES 0805 (2012X06L)]  (hidden comment: Res1)
R29  value 68k  [RES 0805 (2012X06L)]  (hidden comment: Res1)
R30  value 68k  [RES 0805 (2012X06L)]  (hidden comment: Res1)
R31  value 68k  [RES 0805 (2012X06L)]  (hidden comment: Res1)
R32  value 6.8k  [RES 0805 (2012X06L)]  (hidden comment: Res1)
R33  value 6.8k  [RES 0805 (2012X06L)]  (hidden comment: Res1)
R34  value 68k  [RES 0805 (2012X06L)]  (hidden comment: Res1)
R35  value 68k  [RES 0805 (2012X06L)]  (hidden comment: Res1)
R36  value 68k  [RES 0805 (2012X06L)]  (hidden comment: Res1)
R38  value 6.8k  [RES 0805 (2012X06L)]  (hidden comment: Res1)
R40  value 68k  [RES 0805 (2012X06L)]  (hidden comment: Res1)
U11  LM324AD  [SO14_N]  (parts A,B,C,D of 4)
U12  LM324AD  [SO14_N]  (parts A,B,C of 4)

### Ports
input[1..7] (in), output[1..7] (out)

### Nets
+5: C38.2 C40.2 U11.4(V+) U12.4(V+)
-5: C39.2 C41.2 U11.11(V-) U12.11(V-)
GND: C31.1 C32.1 C33.1 C34.1 C35.1 C36.1 C37.1 C38.1 C39.1 C40.1 C41.1 D11.1(A) D12.1(A) D17.1(A) D18.1(A) D23.1(A) D24.1(A) D29.1(A) R22.1 R23.1 R28.1 R29.1 R34.1 R35.1 R40.1 U11.3(IN+) U11.5(IN+) U11.10(IN+) U11.12(IN+) U12.3(IN+) U12.5(IN+) U12.10(IN+)
input1: R20.1  [project net coilL1]
input2: R26.1  [project net coilL2]
input3: R32.1  [project net coilL3]
input4: R38.1  [project net coilL4]
input5: R21.1  [project net coilL5]
input6: R27.1  [project net coilL6]
input7: R33.1  [project net coilL7]
output1: C31.2 D9.2(K) D11.2(K) R18.2 R22.2  [project net ADC1]
output2: C33.2 D15.2(K) D17.2(K) R24.2 R28.2  [project net ADC2]
output3: C35.2 D21.2(K) D23.2(K) R30.2 R34.2  [project net ADC3]
output4: C37.2 D27.2(K) D29.2(K) R36.2 R40.2  [project net ADC4]
output5: C32.2 D10.2(K) D12.2(K) R19.2 R23.2  [project net ADC5]
output6: C34.2 D16.2(K) D18.2(K) R25.2 R29.2  [project net ADC6]
output7: C36.2 D22.2(K) D24.2(K) R31.2 R35.2  [project net ADC7]
NetD4_1: D4.1(A) R18.1 R20.2 U11.2(IN-)
NetD4_2: D4.2(K) D9.1(A) U11.1(OUT)
NetD8_1: D8.1(A) R19.1 R21.2 U12.2(IN-)
NetD8_2: D8.2(K) D10.1(A) U12.1(OUT)
NetD13_1: D13.1(A) R24.1 R26.2 U11.6(IN-)
NetD13_2: D13.2(K) D15.1(A) U11.7(OUT)
NetD14_1: D14.1(A) R25.1 R27.2 U12.6(IN-)
NetD14_2: D14.2(K) D16.1(A) U12.7(OUT)
NetD19_1: D19.1(A) R30.1 R32.2 U11.9(IN-)
NetD19_2: D19.2(K) D21.1(A) U11.8(OUT)
NetD20_1: D20.1(A) R31.1 R33.2 U12.9(IN-)
NetD20_2: D20.2(K) D22.1(A) U12.8(OUT)
NetD25_1: D25.1(A) R36.1 R38.2 U11.13(IN-)
NetD25_2: D25.2(K) D27.1(A) U11.14(OUT)

### Buses and harness runs
bus input[1..7] = port input[1..7]
bus output[1..7] = port output[1..7]

### Notes on the sheet
- (in symbol LM324AD, part A) A
- (in symbol LM324AD, part B) B
- (in symbol LM324AD, part C) C
- (in symbol LM324AD, part D) D

### Library data of the parts
C31-C41 = Cap ceramic: CAP-100Nf
D4 D8-D25 D27 D29 = Diode 1N4148: High Conductance Fast Diode; Published: 8-Jun-2000; LatestRevisionDate: 17-Jul-2002; LatestRevisionNote: Re-released for DXP Platform.; DatasheetVersion: 1997; PackageReference: DO-35; Publisher: Altium Limited; PackageDescription: Diode, Axial; Body 3.8 x 1.9 mm (LxDia. max), Lead Dia. 0.53 mm (max); Code_JEDEC: DO-204-AH; ComponentLink1Description: Manufacturer Link; ComponentLink1URL: http://www.fairchildsemi.com/; ComponentLink2Description: Datasheet; ComponentLink2URL: http://www.fairchildsemi.com/ds/1N%2F1N4148.pdf
R18-R36 R38 R40 = Res1: Resistor; Published: 8-Jun-2000; LatestRevisionDate: 17-Jul-2002; LatestRevisionNote: Re-released for DXP Platform.; PackageReference: AXIAL-0.3; Publisher: Altium Limited; PackageDescription: Axial Device, Thru-Hole; 2 Leads; 0.3 in Pin Spacing
U11 U12 = LM324AD: Low-Power Quad Operational Amplifier; Published: 24-Aug-2001; LatestRevisionDate: 13-Apr-2006; LatestRevisionNote: IPC-7351 Footprint Added.; DatasheetVersion: Nov-1997; PackageVersion: Sep-1998; PackageReference: SO14; Publisher: Altium Limited; PackageDescription: 14-Pin Small Outline Integrated Circuit 1.27 mm Pitch; Code_IPC: SOIC127P600-14; ComponentLink1Description: Manufacturer Link; ComponentLink1URL: http://www.st.com/; ComponentLink2Description: Datasheet; ComponentLink2URL: http://www.st.com/stonline/products/literature/ds/4797/lm224a.pdf

## Sheet power.SchDoc
size A4
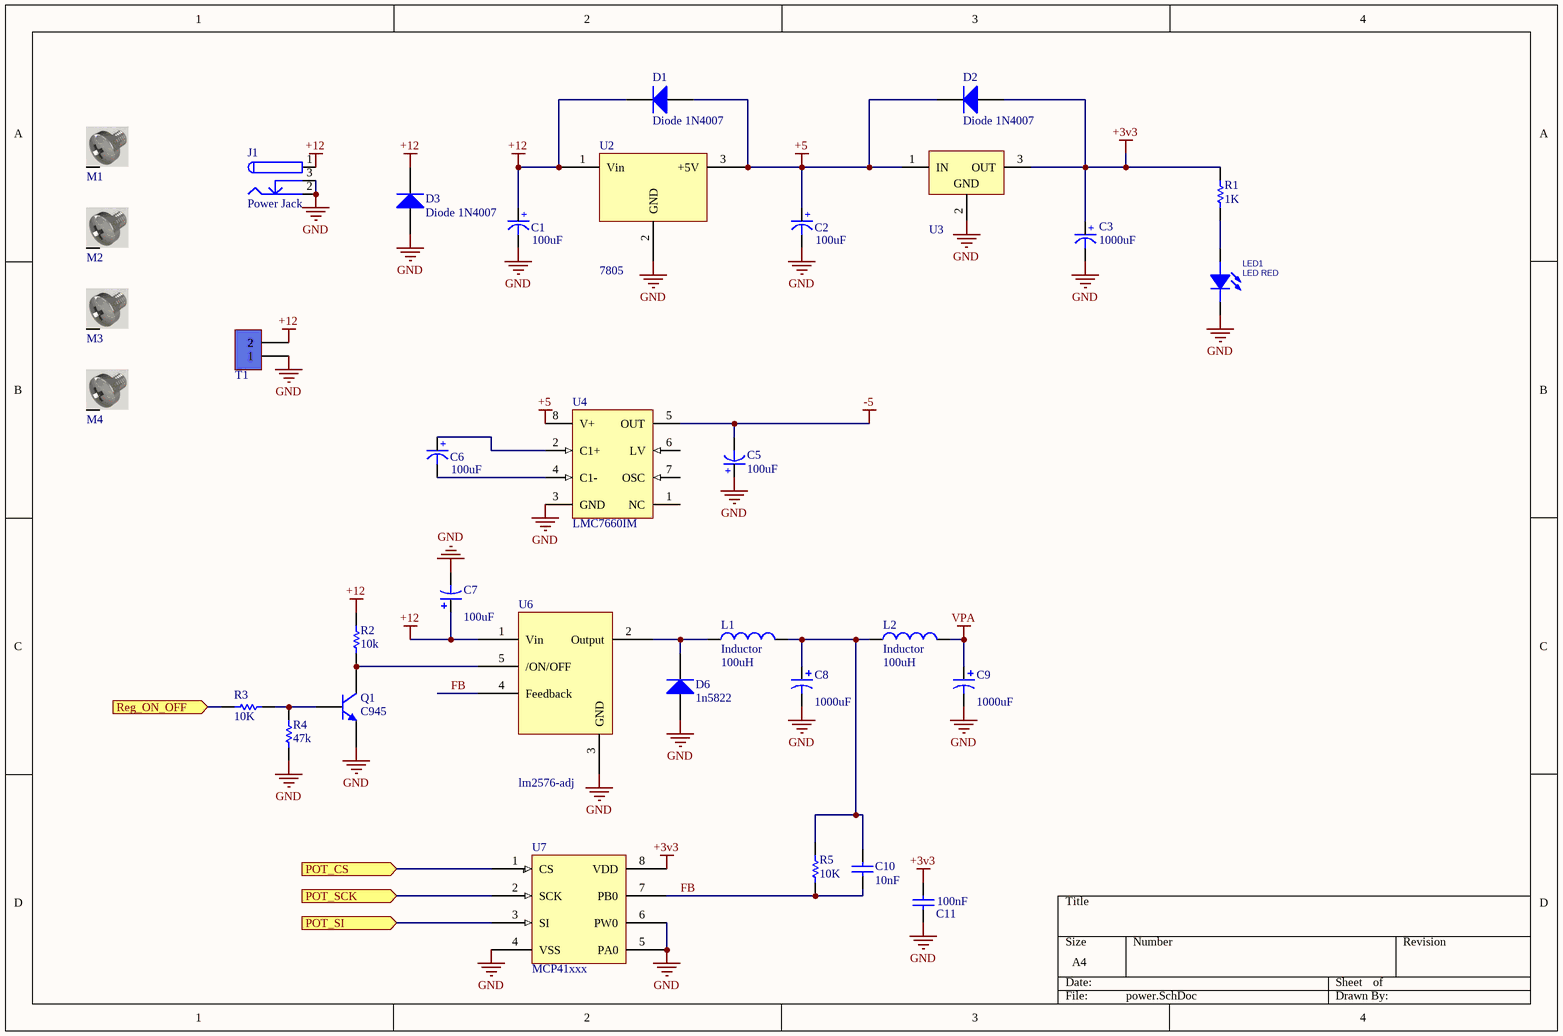
[diagram p7: power.SchDoc]

### Parts
C1  100uF  [Cap - 3.5mm - 2]
C2  100uF  [Cap - 3.5mm - 2]
C3  1000uF  [Cap - 3.5mm - 2]
C5  100uF  [Cap - 3.5mm - 2]
C6  100uF  [Cap - 3.5mm - 2]
C7  value 100uF  [Cap SMD electrolite-6.3mm]
C8  value 1000uF  [Cap SMD electrolite-10.3mm]
C9  value 1000uF  [Cap SMD electrolite-10.3mm]
C10  value 10nF  [SMD_CAP_0805]  (hidden comment: Cap)
C11  value 100nF  [SMD_CAP_0805]  (hidden comment: Cap)
D1  Diode 1N4007  [SMA DIODE 2]
D2  Diode 1N4007  [SMA DIODE 2]
D3  Diode 1N4007  [SMA DIODE 2]
D6  1n5822  [DO214AC SMA]
J1  Power Jack  [Power Jack]
L1  Inductor  value 100uH  [inductor]
L2  Inductor  value 100uH  [inductor]
LED1  LED RED  [led_0805]
M1  Screw  [Screw]  (value not drawn)
M2  Screw  [Screw]  (value not drawn)
M3  Screw  [Screw]  (value not drawn)
M4  Screw  [Screw]  (value not drawn)
Q1  C945  [SOT23_N]
R1  1K  [RES 0805 (2012X06L)]
R2  value 10k  [RES 0805 (2012X06L)]  (hidden comment: Res1)
R3  value 10K  [RES 0805 (2012X06L)]  (hidden comment: Res1)
R4  value 47k  [RES 0805 (2012X06L)]  (hidden comment: Res1)
R5  10K  [RES 0805 (2012X06L)]
T1  Terminal  [Terminal 1*2_1]  (value not drawn)
U2  7805  [REG-7805-WALL]
U3  Voltage Regulator  [REG-7805-WALL]  (value not drawn)
U4  LMC7660IM  [M08A_N]
U6  lm2576-adj  [2596]
U7  MCP41xxx  [SO8_M]

### Ports
POT_CS (in), POT_SCK (in), POT_SI (in), Reg_ON_OFF (in)

### Nets
+3v3: C3.1(+) C11.2 D2.1(A) R1.2 U3.3(OUT) U7.8(VDD)
+5: C2.1(+) D1.1(A) D2.2(K) U2.3(+5V) U3.1(IN) U4.8(V+)
+12: C1.1(+) C7.1 D1.2(K) D3.2(K) J1.1 R2.2 T1.2 U2.1(Vin) U6.1(Vin)
-5: C5.2(-) U4.5(OUT)
GND: C1.2(-) C2.2(-) C3.2(-) C5.1(+) C7.2 C8.2 C9.2 C11.1 D3.1(A) D6.1(A) J1.2 J1.3 LED1.2(CATHODE) Q1.2(E) R4.1 T1.1 U2.2(GND) U3.2(GND) U4.3(GND) U6.3(GND) U7.4(VSS) U7.5(PA0) U7.6(PW0)
VPA: C9.1 L2.2
FB: C10.2 R5.1 U6.4(Feedback) U7.7(PB0)
POT_CS: U7.1(CS) ; port POT_CS
POT_SCK: U7.2(SCK) ; port POT_SCK
POT_SI: U7.3(SI) ; port POT_SI
reg_ON_OFF: R3.1 ; port Reg_ON_OFF
NetC6_1: C6.1(+) U4.2(C1+)
NetC6_2: C6.2(-) U4.4(C1-)
NetC8_1: C8.1 C10.1 L1.2 L2.1 R5.2
NetD6_2: D6.2(K) L1.1 U6.2(Output)
NetLED1_1: LED1.1(ANODE) R1.1
NetQ1_1: Q1.1(B) R3.2 R4.2
NetQ1_3: Q1.3(C) R2.1 U6.5(/ON/OFF)

Not connected (* = marked no-connect by the designer): M1 S; M2 S; M3 S; M4 S; U4 1(NC) 6(LV) 7(OSC)

### Library data of the parts
C1-C3 C5 C6 = Cap-Polar: Polar Capacitor; Designer: Saeid Jorablo; Organazation: ControTec; Voltage: 16V; Adding Date: 1387/12/20
  C1 C2 C5 C6: Value: 100uF
  C3: Value: 1000uF
C7-C9 = Cap Pol1: Polarized Capacitor (Radial); Published: 8-Jun-2000; LatestRevisionDate: 17-Jul-2002; LatestRevisionNote: Re-released for DXP Platform.; PackageReference: RB7.6-15; Publisher: Altium Limited; PackageDescription: Polarized Capacitor (Radial); 2 Leads
C10 C11 = Cap ceramic: CAP-100Nf
D1-D3 D6 = Diode 1N4007: 1 Amp General Purpose Rectifier; Published: 8-Jun-2000; LatestRevisionDate: 17-Jul-2002; LatestRevisionNote: Re-released for DXP Platform.; DatasheetVersion: 1998; PackageVersion: Aug-1999; PackageReference: DO-41; Publisher: Altium Limited; PackageDescription: Diode, Axial; Body 5.2 x 2.7 mm (LxDia. max), Lead Dia. 0.86 mm (max); Code_JEDEC: DO-204-AL; ComponentLink1Description: Manufacturer Link; ComponentLink1URL: http://www.fairchildsemi.com/; ComponentLink2Description: Datasheet; ComponentLink2URL: http://www.fairchildsemi.com/ds/1N%2F1N4001.pdf
J1 = Power Jack: Designer: Saeid Jorablo; Company: Personal; Project Name: Laser; Adding Date: 10/21/2009
L1 L2 = Inductor: Code_IEC: 1005; Published: 8-Jun-2000; LatestRevisionDate: 29-May-2009; LatestRevisionNote: IPC-7351 Footprint Added.; PackageReference: 0402-A; Publisher: Altium Limited; PackageDescription: Chip Inductor; Code_JEITA: 0402
LED1 = LED 5MM: as LED4 on sheet accesory; Data: 16-12-2016; Link: *; Part.No: *
M1-M4 = Board Screw: Board Screw With Spacer
Q1 = C945: NPN Silicon Epitaxial Planar Transistor; Published: 2017-2-8; LatestRevisionDate: 2017; LatestRevisionNote: IPC-7351 Footprint Added.; DatasheetVersion: 2017; PackageVersion: 2017-2-8; PackageReference: SOT23; Publisher: Abbas Basereh; PackageDescription: 3-Pin SOT-23 Package 0.95 mm Pitch, 2.3 mm Lead Span; ComponentLink1Description: Manufacturer Link; ComponentLink1URL: http://www.taitroncomponents.com/; ComponentLink2Description: Datasheet; ComponentLink2URL: http://www.taitroncomponents.com/
R1 R5 = RES Axial 0.25W: Designer: Abbas Basereh; Desc.: RES Axial 0.25W; Data: 4-1-2017
R2-R4 = Res1: Resistor; Published: 8-Jun-2000; LatestRevisionDate: 17-Jul-2002; LatestRevisionNote: Re-released for DXP Platform.; PackageReference: AXIAL-0.3; Publisher: Altium Limited; PackageDescription: Axial Device, Thru-Hole; 2 Leads; 0.3 in Pin Spacing
T1 = Terminal 1*2: Terminal 2 Pin 250VAC 16A; Designer: Seyed Mohsen Ghasemain; E-mail: picpars@gmail.com; ComponentLinkURL: www.picpars.com
U2 = 7805: Regulator
U3 = LF33: Voltage Regulator 3.3 Volt
U4 = LMC7660IM: Switched Capacitor Voltage Converter; Manufacturer: National Semiconductor; CompType: Switch Caps; PackageTopMarking: NSZXTT*LMC76*60IM; PowerWise: N; Published: 4-Dec-2008; DatasheetVersion: Feb-2005; PackageVersion: revL, Sep-2006; PackageReference: M08A; Publisher: Altium Limited; PackageDescription: SOIC Narrow, 4.9 x 3.9 x 1.45mm, 8 Lead, 1.27mm Pitch; PartNumber: LMC7660IM; RoHS: O; PinCount: 8; DigiKeyPartNumber: LMC7660IM-ND; Code_JEDEC: MS-012-AA; Code_IPC: SOIC127P600-8; ComponentLink1Description: LMC7660 Datasheet; ComponentLink1URL: http://www.national.com/ds/LM/LMC7660.pdf; ComponentLink2Description: LMC7660 Web Page; ComponentLink2URL: http://www.national.com/pf/LM/LMC7660.html; ComponentLink3Description: M08A Package Page; ComponentLink3URL: http://www.national.com/packaging/folders/m08a.html
U6 = lm2596

## Nets that join several sheets
+3v3: micro (22 pins), accesory (11 pins), U_PA_group/PA1 (R9_PA1.1), U_PA_group/PA2 (R9_PA2.1), U_PA_group/PA3 (R9_PA3.1), U_PA_group/PA4 (R9_PA4.1), U_PA_group/PA5 (R9_PA5.1), U_PA_group/PA6 (R9_PA6.1), U_PA_group/PA7 (R9_PA7.1), power (6 pins)
+5: accesory (P2.1 R37.2 R39.2 W1.2), PA_group (6 pins), rectifiers (C38.2 C40.2 U11.4 U12.4), power (6 pins)
+12: U_PA_group/PA1 (C26_PA1.+ C27_PA1.1 U8_PA1.6), U_PA_group/PA2 (C26_PA2.+ C27_PA2.1 U8_PA2.6), U_PA_group/PA3 (C26_PA3.+ C27_PA3.1 U8_PA3.6), U_PA_group/PA4 (C26_PA4.+ C27_PA4.1 U8_PA4.6), U_PA_group/PA5 (C26_PA5.+ C27_PA5.1 U8_PA5.6), U_PA_group/PA6 (C26_PA6.+ C27_PA6.1 U8_PA6.6), U_PA_group/PA7 (C26_PA7.+ C27_PA7.1 U8_PA7.6), power (9 pins)
-5: rectifiers (C39.2 C41.2 U11.11 U12.11), power (C5.2 U4.5)
GND: micro (24 pins), accesory (17 pins), PA_group (8 pins), U_PA_group/PA1 (10 pins), U_PA_group/PA1/L (LED2_U_PA_group_PA1_L.2 LED3_U_PA_group_PA1_L.2), U_PA_group/PA2 (10 pins), U_PA_group/PA2/L (LED2_U_PA_group_PA2_L.2 LED3_U_PA_group_PA2_L.2), U_PA_group/PA3 (10 pins), U_PA_group/PA3/L (LED2_U_PA_group_PA3_L.2 LED3_U_PA_group_PA3_L.2), U_PA_group/PA4 (10 pins), U_PA_group/PA4/L (LED2_U_PA_group_PA4_L.2 LED3_U_PA_group_PA4_L.2), U_PA_group/PA5 (10 pins), U_PA_group/PA5/L (LED2_U_PA_group_PA5_L.2 LED3_U_PA_group_PA5_L.2), U_PA_group/PA6 (10 pins), U_PA_group/PA6/L (LED2_U_PA_group_PA6_L.2 LED3_U_PA_group_PA6_L.2), U_PA_group/PA7 (10 pins), U_PA_group/PA7/L (LED2_U_PA_group_PA7_L.2 LED3_U_PA_group_PA7_L.2), rectifiers (32 pins), power (23 pins)
VPA: PA_group (C48.1 C49.1), U_PA_group/PA1 (5 pins), U_PA_group/PA2 (5 pins), U_PA_group/PA3 (5 pins), U_PA_group/PA4 (5 pins), U_PA_group/PA5 (5 pins), U_PA_group/PA6 (5 pins), U_PA_group/PA7 (5 pins), power (C9.1 L2.2)
ADC1: micro (U1.36), rectifiers (5 pins)
ADC2: micro (U1.35), rectifiers (5 pins)
ADC3: micro (U1.32), rectifiers (5 pins)
ADC4: micro (U1.31), rectifiers (5 pins)
ADC5: micro (U1.16), rectifiers (5 pins)
ADC6: micro (U1.17), rectifiers (5 pins)
ADC7: micro (U1.15), rectifiers (5 pins)
ADC10: micro (U1.25), accesory (C45.2 R43.3)
ADC11: micro (U1.26), accesory (C46.2 R44.3)
clk1: micro (U1.45), U_PA_group/PA1 (R9_PA1.2 U8_PA1.2)
clk2: micro (U1.48), U_PA_group/PA2 (R9_PA2.2 U8_PA2.2)
clk3: micro (U1.60), U_PA_group/PA3 (R9_PA3.2 U8_PA3.2)
clk4: micro (U1.62), U_PA_group/PA4 (R9_PA4.2 U8_PA4.2)
clk5: micro (U1.64), U_PA_group/PA5 (R9_PA5.2 U8_PA5.2)
clk6: micro (U1.66), U_PA_group/PA6 (R9_PA6.2 U8_PA6.2)
clk7: micro (U1.89), U_PA_group/PA7 (R9_PA7.2 U8_PA7.2)
clk_p1: micro (U1.44), U_PA_group/PA1 (R13_PA1.1 U8_PA1.4)
clk_p2: micro (U1.47), U_PA_group/PA2 (R13_PA2.1 U8_PA2.4)
clk_p3: micro (U1.59), U_PA_group/PA3 (R13_PA3.1 U8_PA3.4)
clk_p4: micro (U1.61), U_PA_group/PA4 (R13_PA4.1 U8_PA4.4)
clk_p5: micro (U1.63), U_PA_group/PA5 (R13_PA5.1 U8_PA5.4)
clk_p6: micro (U1.65), U_PA_group/PA6 (R13_PA6.1 U8_PA6.4)
clk_p7: micro (U1.77), U_PA_group/PA7 (R13_PA7.1 U8_PA7.4)
coilH1: PA_group (P1.1 P1.2), U_PA_group/PA1 (Q2_PA1.5 Q2_PA1.6 Q2_PA1.7 Q2_PA1.8)
coilH2: PA_group (P1.5 P1.6), U_PA_group/PA2 (Q2_PA2.5 Q2_PA2.6 Q2_PA2.7 Q2_PA2.8)
coilH3: PA_group (P1.9 P1.10), U_PA_group/PA3 (Q2_PA3.5 Q2_PA3.6 Q2_PA3.7 Q2_PA3.8)
coilH4: PA_group (P1.13 P1.14), U_PA_group/PA4 (Q2_PA4.5 Q2_PA4.6 Q2_PA4.7 Q2_PA4.8)
coilH5: PA_group (P1.17 P1.18), U_PA_group/PA5 (Q2_PA5.5 Q2_PA5.6 Q2_PA5.7 Q2_PA5.8)
coilH6: PA_group (P1.21 P1.22), U_PA_group/PA6 (Q2_PA6.5 Q2_PA6.6 Q2_PA6.7 Q2_PA6.8)
coilH7: PA_group (P1.25 P1.26), U_PA_group/PA7 (Q2_PA7.5 Q2_PA7.6 Q2_PA7.7 Q2_PA7.8)
coilL1: PA_group (P1.3 P1.4), U_PA_group/PA1 (R14_PA1.2), rectifiers (R20.1)
coilL2: PA_group (P1.7 P1.8), U_PA_group/PA2 (R14_PA2.2), rectifiers (R26.1)
coilL3: PA_group (P1.11 P1.12), U_PA_group/PA3 (R14_PA3.2), rectifiers (R32.1)
coilL4: PA_group (P1.15 P1.16), U_PA_group/PA4 (R14_PA4.2), rectifiers (R38.1)
coilL5: PA_group (P1.19 P1.20), U_PA_group/PA5 (R14_PA5.2), rectifiers (R21.1)
coilL6: PA_group (P1.23 P1.24), U_PA_group/PA6 (R14_PA6.2), rectifiers (R27.1)
coilL7: PA_group (P1.27 P1.28), U_PA_group/PA7 (R14_PA7.2), rectifiers (R33.1)
G_led1: PA_group (U9.2), U_PA_group/PA1/L (R17_U_PA_group_PA1_L.2)
G_led2: PA_group (U9.15), U_PA_group/PA2/L (R17_U_PA_group_PA2_L.2)
G_led3: PA_group (U10.4), U_PA_group/PA3/L (R17_U_PA_group_PA3_L.2)
G_led4: PA_group (U9.4), U_PA_group/PA4/L (R17_U_PA_group_PA4_L.2)
G_led5: PA_group (U10.2), U_PA_group/PA5/L (R17_U_PA_group_PA5_L.2)
G_led6: PA_group (U10.15), U_PA_group/PA6/L (R17_U_PA_group_PA6_L.2)
G_led7: PA_group (U9.6), U_PA_group/PA7/L (R17_U_PA_group_PA7_L.2)
I2C_SCL: micro (U1.92), accesory (OLED1.2 R48.1)
I2C_SDA: micro (U1.93), accesory (OLED1.1 R47.1)
LED1: micro (U1.30), accesory (R45.1)
LED2: micro (U1.98), accesory (R46.1)
LED_data: micro (U1.87), PA_group (U9.14)
NRF_CE: micro (U1.2), accesory (U5.3)
NRF_CSN: micro (U1.3), accesory (U5.4)
NRF_MISO: micro (U1.4), accesory (U5.7)
NRF_MOSI: micro (U1.5), accesory (U5.6)
NRF_SCK: micro (U1.1), accesory (U5.5)
PB1: micro (U1.41), accesory (C43.2 R41.2 S2.1)
PB2: micro (U1.90), accesory (C44.2 R42.2 S3.1)
POT_CS: micro (U1.51), power (U7.1)
POT_SCK: micro (U1.52), power (U7.2)
POT_SI: micro (U1.18), power (U7.3)
R_led1: PA_group (U9.3), U_PA_group/PA1/L (R16_U_PA_group_PA1_L.2)
R_led2: PA_group (U9.1), U_PA_group/PA2/L (R16_U_PA_group_PA2_L.2)
R_led3: PA_group (U10.5), U_PA_group/PA3/L (R16_U_PA_group_PA3_L.2)
R_led4: PA_group (U9.5), U_PA_group/PA4/L (R16_U_PA_group_PA4_L.2)
R_led5: PA_group (U10.3), U_PA_group/PA5/L (R16_U_PA_group_PA5_L.2)
R_led6: PA_group (U10.1), U_PA_group/PA6/L (R16_U_PA_group_PA6_L.2)
R_led7: PA_group (U9.7), U_PA_group/PA7/L (R16_U_PA_group_PA7_L.2)
reg_clk: micro (U1.79), PA_group (U9.11 U10.11)
reg_ON_OFF: micro (U1.91), power (R3.1)
RX1: micro (U1.83), accesory (H1.2)
RX2: micro (U1.24), accesory (H3.2)
serial_clock: micro (U1.78), PA_group (U9.12 U10.12)
TX1: micro (U1.80), accesory (H1.3)
TX2: micro (U1.23), accesory (H3.3)
USB_DM: micro (U1.70), accesory (P2.2 p3.2)
USB_DP: micro (U1.71), accesory (P2.3 p3.3)
USB_ID: micro (U1.69), accesory (p3.4)